# EAGLE schematic wk3 (EAGLE 9.5.0)
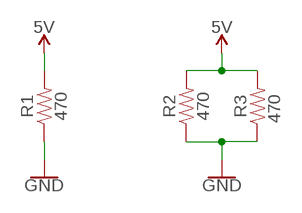
[diagram p0: schematic, sheet 1]

## Parts
R1  470  RESISTORAXIAL-0.3  [AXIAL-0.3]
R2  470  RESISTORAXIAL-0.3  [AXIAL-0.3]
R3  470  RESISTORAXIAL-0.3  [AXIAL-0.3]

## Nets
GND: R1.P$1 R2.P$1 R3.P$1
VCC: R1.P$2 R2.P$2 R3.P$2 ; supply symbol labelled 5V

## Library data of the parts
R1-R3 = SparkFun-Resistors:RESISTOR: Generic Resistor Package